# EAGLE design 2278657L (EAGLE 8.0.1)
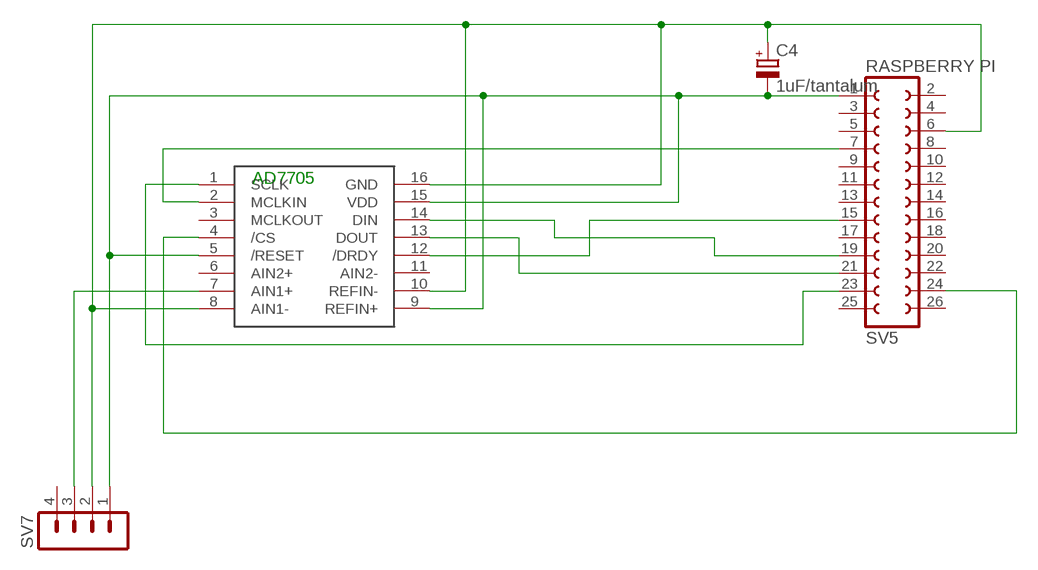
[diagram p0: schematic, sheet 1]

## Parts
C4  1uF/tantalum  CPOL-EUTT2D7  [TT2D7]
SV5  RASPBERRY PI  FE13-2  [FE13-2]
SV7  MA04-1  [MA04-1]
U$3  AD7705  [DIP16]

## Nets
N$22: SV5.7 U$3.2(MCLKIN)
N$23: SV7.3 U$3.7(AIN1+)
N$25: C4.+ SV5.6 SV7.2 U$3.8(AIN1-) U$3.10(REFIN-) U$3.16(GND)
N$26: SV5.23 U$3.1(SCLK)
N$27: C4.- SV5.1 SV7.1 U$3.5(/RESET) U$3.9(REFIN+) U$3.15(VDD)
N$28: SV5.24 U$3.4(/CS)
N$32: SV5.15 U$3.12(/DRDY)
N$33: SV5.21 U$3.13(DOUT)
N$34: SV5.19 U$3.14(DIN)
Unconnected: SV5.2 SV5.3 SV5.4 SV5.5 SV5.8 SV5.9 SV5.10 SV5.11 SV5.12 SV5.13 SV5.14 SV5.16 SV5.17 SV5.18 SV5.20 SV5.22 SV5.25 SV5.26 SV7.4 U$3.3(MCLKOUT) U$3.6(AIN2+) U$3.11(AIN2-)

## Notes on the sheet
- AD7705

## Library data of the parts
C4 = rcl:CPOL-EU: POLARIZED CAPACITOR, European symbol
SV5 = con-lsta:FE13-2: FEMALE HEADER; OC_FARNELL: unknown; OC_NEWARK: unknown
SV7 = con-lstb:MA04-1: PIN HEADER; OC_FARNELL: unknown; OC_NEWARK: unknown
U$3 = rpi:AD7705

## Board
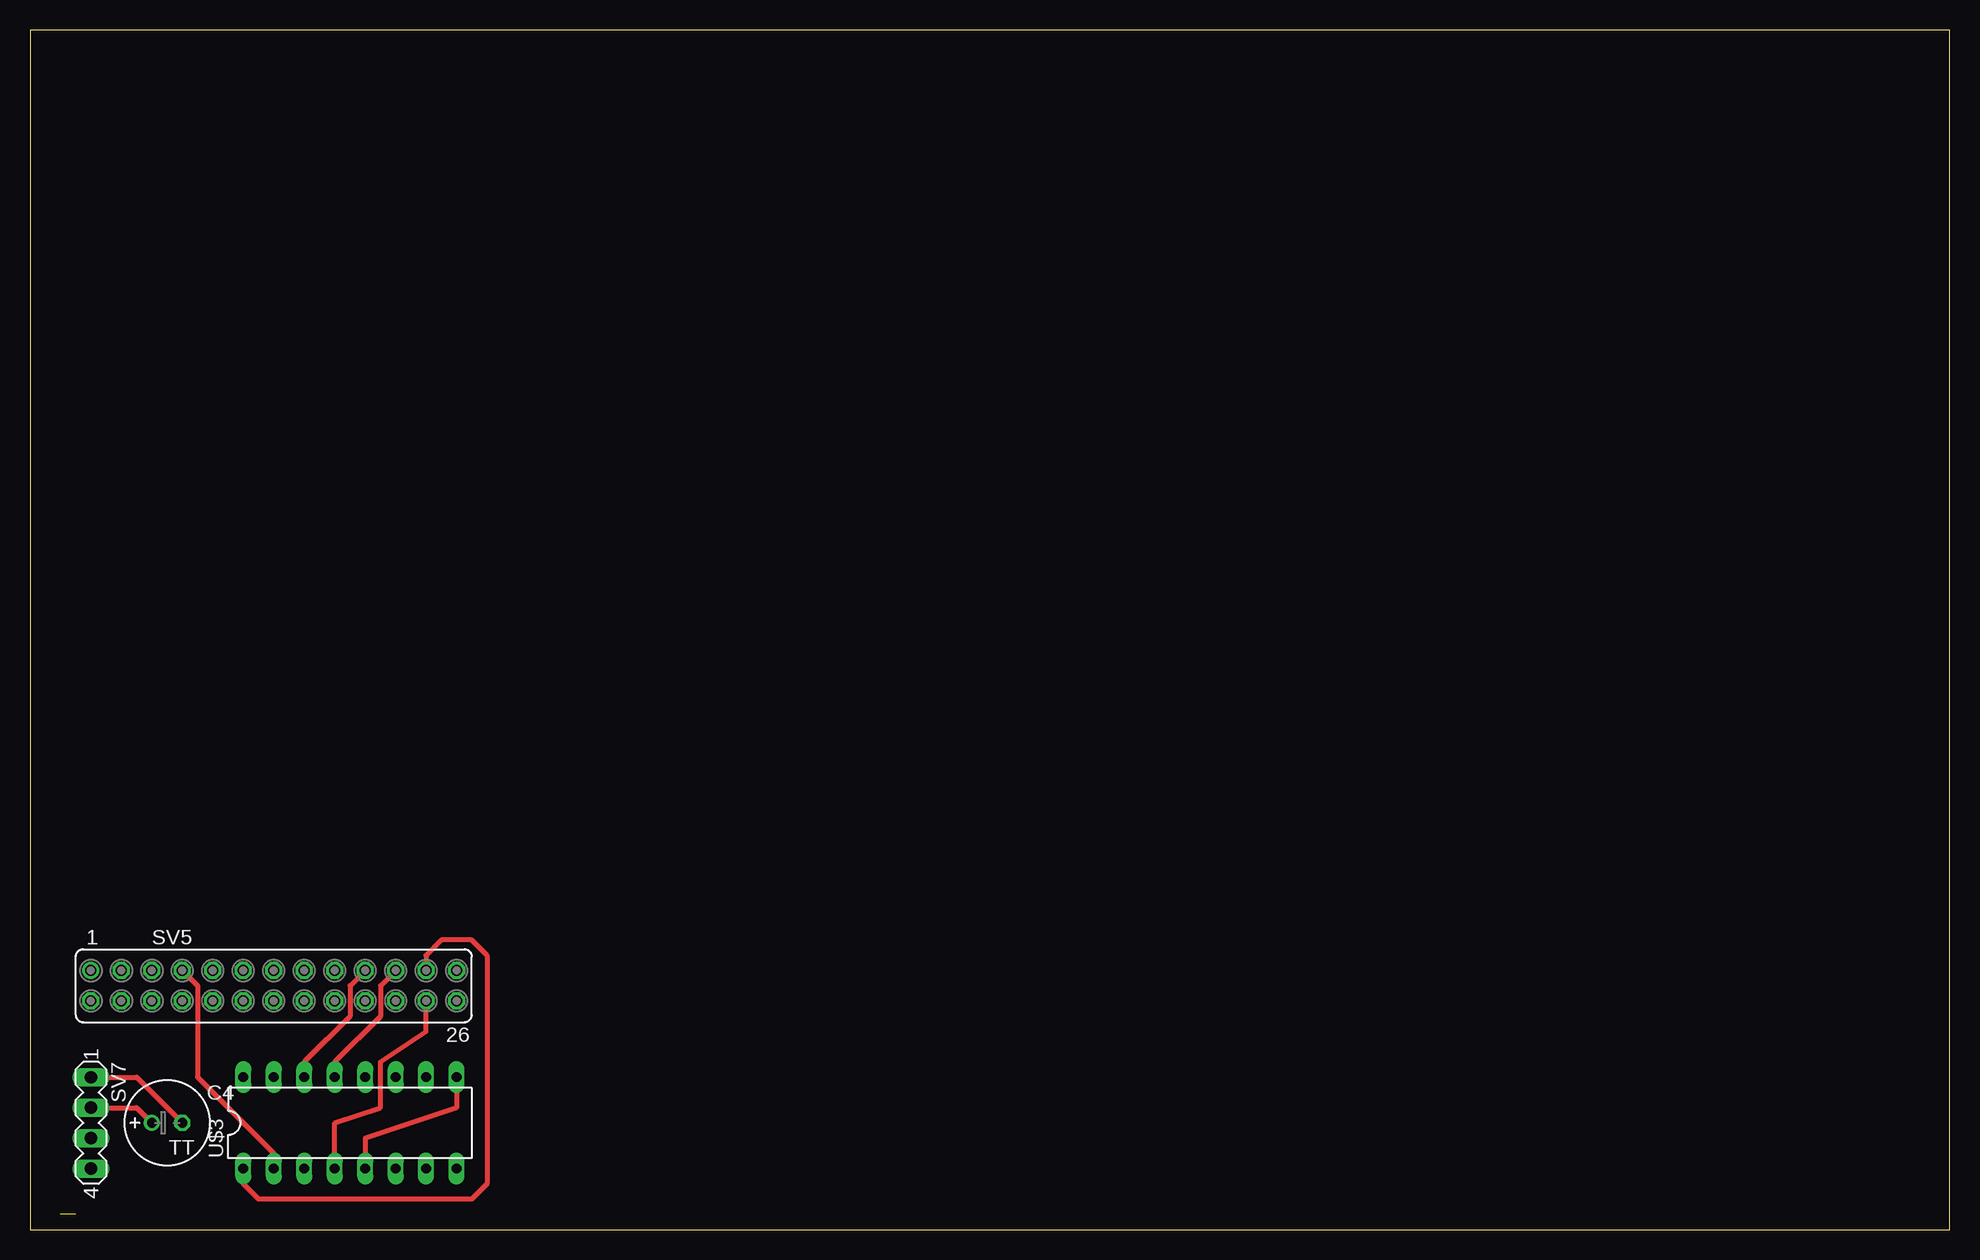
[diagram p1: board, top side]
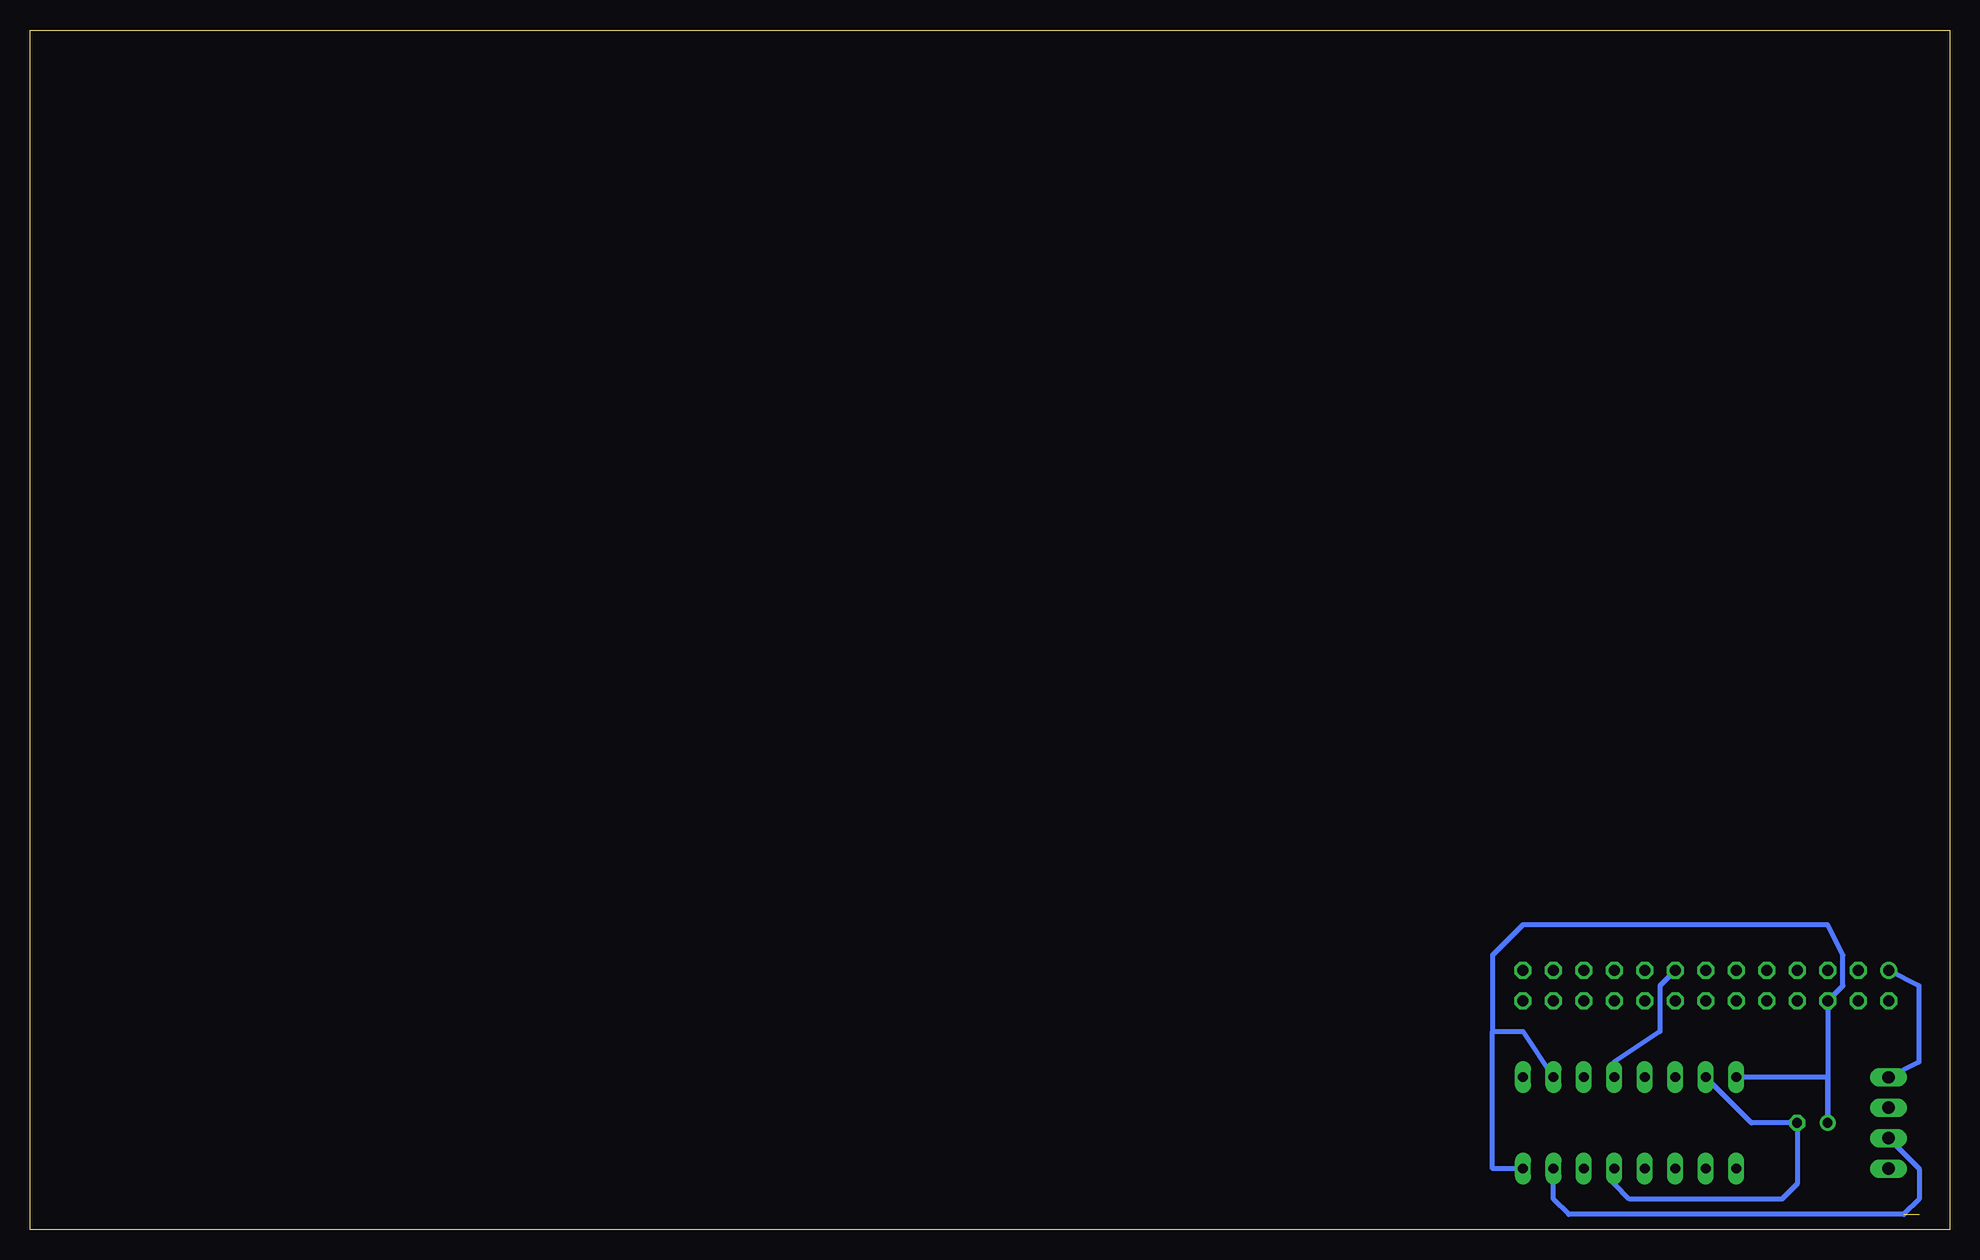
[diagram p2: board, bottom side, seen from below]

Size 160 x 100 mm. Coordinates in mm from the lower left corner, seen from the top.
Outline: 0,0 160,0 160,100 0,100 0,0
Copper layers (1*16): Top 0.035mm / dielectric 1.5mm / Bottom 0.035mm
Design rules "default": minimum track width 10mil, minimum drill 24mil, track to track 8mil, track to pad 8mil, pad to pad 8mil, via to via 8mil, smd to smd 8mil, copper to edge 40mil, drill to drill 8mil, minimum pad ring 10mil, minimum via ring 8mil, stop-mask expansion 4mil, vias tented up to drill 0mil, thermal gap 10mil

### Footprints (pad centres in the part's own frame; a part is rotated, then mirrored left to right if it is on the bottom)
TT2D7 = drill 0.813: + -1.27,0 | drill 0.813 octagon: - 1.27,0
FE13-2 = drill 0.914: 1 -15.24,1.27 | drill 0.914 octagon: 2 -15.24,-1.27; 3 -12.7,1.27; 4 -12.7,-1.27; 5 -10.16,1.27; 6 -10.16,-1.27; 7 -7.62,1.27; 8 -7.62,-1.27; 9 -5.08,1.27; 10 -5.08,-1.27; 11 -2.54,1.27; 12 -2.54,-1.27; 13 0,1.27; 14 0,-1.27; 15 2.54,1.27; 16 2.54,-1.27; 17 5.08,1.27; 18 5.08,-1.27; 19 7.62,1.27; 20 7.62,-1.27; 21 10.16,1.27; 22 10.16,-1.27; 23 12.7,1.27; 24 12.7,-1.27; 25 15.24,1.27; 26 15.24,-1.27
MA04-1 = drill 1.016 long: 1 -3.81,0; 2 -1.27,0; 3 1.27,0; 4 3.81,0
DIP16 = drill 0.813 long: 1 -8.89,-3.81; 2 -6.35,-3.81; 3 -3.81,-3.81; 4 -1.27,-3.81; 5 1.27,-3.81; 6 3.81,-3.81; 7 6.35,-3.81; 8 8.89,-3.81; 9 8.89,3.81; 10 6.35,3.81; 11 3.81,3.81; 12 1.27,3.81; 13 -1.27,3.81; 14 -3.81,3.81; 15 -6.35,3.81; 16 -8.89,3.81

### Placement (x,y rotation side)
C4  11.43,8.89 0 top
SV5  20.32,20.32 0 top
SV7  5.08,8.89 270 top
U$3  26.67,8.89 0 top

### Tracks (layer width: path | path; a pad name or v marks a point on that pad's centre or on a via)
N$22
  Top 0.406: SV5.7 13.97,20.32 13.97,12.7 20.32,6.35 U$3.2
N$23  (1 unrouted)
  Bottom 0.406: SV7.3 2.54,5.08 2.54,2.54 3.81,1.27 31.75,1.27 33.02,2.54 U$3.7
N$25
  Top 0.254: 10.19,19 SV5.6
  Top 0.406: SV7.2 8.89,10.16 C4.+
  Bottom 0.254: SV5.6 10.19,19
  Bottom 0.406: U$3.16 10.16,12.7 C4.+ SV5.6 8.89,20.32 8.89,22.86 10.16,25.4 35.56,25.4 38.1,22.86 38.1,16.51 | 38.1,16.51 35.56,16.51 U$3.10 | U$3.8 38.1,5.08 38.1,16.51
N$26
  Top 0.406: U$3.1 17.78,3.81 19.05,2.54 36.83,2.54 38.1,3.81 38.1,22.86 36.83,24.13 34.29,24.13 33.02,22.86 SV5.23
N$27
  Top 0.406: SV7.1 8.89,12.7 C4.- | U$3.9 35.56,10.16 27.94,7.62 U$3.5
  Bottom 0.254: U$3.15 20.24,12.6 | 12.7,8.94 C4.- | 5.16,12.83 SV7.1
  Bottom 0.406: U$3.15 16.51,8.89 C4.- 12.7,3.81 13.97,2.54 26.67,2.54 27.94,3.81 U$3.5 | SV7.1 2.54,13.97 2.54,20.32 SV5.1
N$28
  Top 0.406: U$3.4 25.4,8.89 29.21,10.16 29.21,13.97 33.02,16.51 SV5.24
N$32
  Bottom 0.406: SV5.15 24.13,20.32 24.13,16.51 27.94,13.97 U$3.12
N$33
  Top 0.406: SV5.21 29.21,20.32 29.21,17.78 25.4,13.97 U$3.13
N$34
  Top 0.406: SV5.19 26.67,20.32 26.67,17.78 22.86,13.97 U$3.14